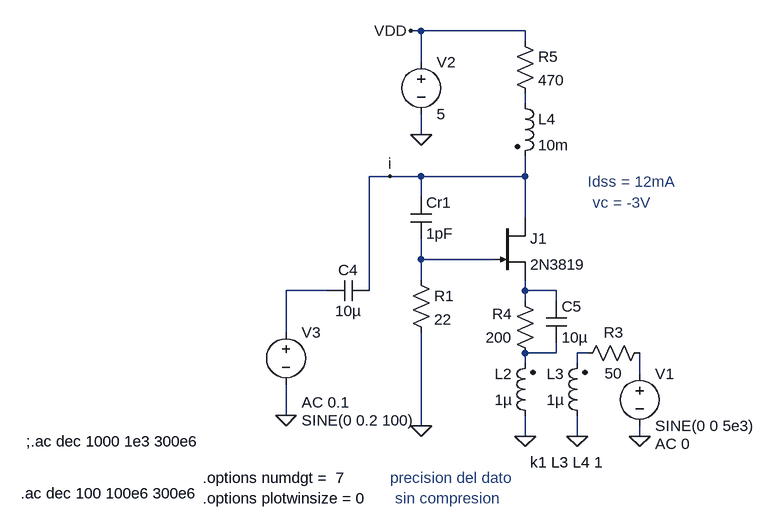
[diagram p0: schematic Draft1.asc]
Draft1.asc, the LTspice schematic file:
Version 4
SHEET 1 880 680
WIRE 176 -272 160 -272
WIRE 336 -272 176 -272
WIRE 336 -256 336 -272
WIRE 176 -224 176 -272
WIRE 336 -160 336 -176
WIRE 176 -112 176 -144
WIRE 128 -48 96 -48
WIRE 176 -48 128 -48
WIRE 336 -48 336 -80
WIRE 336 -48 176 -48
WIRE 176 -16 176 -48
WIRE 336 16 336 -48
WIRE 176 80 176 48
WIRE 288 80 176 80
WIRE 176 112 176 80
WIRE 32 128 -32 128
WIRE 96 128 96 -48
WIRE 336 128 336 112
WIRE 384 128 336 128
WIRE 336 144 336 128
WIRE 384 144 384 128
WIRE -32 192 -32 128
WIRE 384 224 384 208
WIRE 384 224 336 224
WIRE 432 224 416 224
WIRE 336 240 336 224
WIRE 416 240 416 224
WIRE 512 256 512 224
WIRE -32 320 -32 272
WIRE 176 336 176 192
WIRE 336 352 336 320
WIRE 416 352 416 320
WIRE 512 352 512 336
FLAG 176 336 0
FLAG 336 352 0
FLAG 416 352 0
FLAG 160 -272 VDD
FLAG 512 352 0
FLAG 176 -112 0
FLAG -32 320 0
FLAG 128 -48 i
SYMBOL cap 160 -16 R0
SYMATTR InstName Cr1
SYMATTR Value 1pF
SYMBOL res 160 96 R0
SYMATTR InstName R1
SYMATTR Value 22
SYMBOL ind2 352 336 R180
WINDOW 0 36 80 Left 2
WINDOW 3 36 40 Left 2
SYMATTR InstName L2
SYMATTR Value 1µ
SYMATTR Type ind
SYMBOL ind2 432 336 R180
WINDOW 0 36 80 Left 2
WINDOW 3 36 40 Left 2
SYMATTR InstName L3
SYMATTR Value 1µ
SYMATTR Type ind
SYMBOL njf 288 16 R0
SYMATTR InstName J1
SYMATTR Value 2N3819
SYMBOL voltage 512 240 R0
WINDOW 123 24 124 Left 2
WINDOW 39 24 124 Left 2
SYMATTR Value2 AC 0
SYMATTR InstName V1
SYMATTR Value SINE(0 0 5e3)
SYMBOL voltage 176 -240 R0
WINDOW 123 0 0 Left 0
WINDOW 39 0 0 Left 0
SYMATTR InstName V2
SYMATTR Value 5
SYMBOL cap 32 144 R270
WINDOW 0 32 32 VTop 2
WINDOW 3 0 32 VBottom 2
SYMATTR InstName C4
SYMATTR Value 10µ
SYMBOL res 528 208 R90
WINDOW 0 0 56 VBottom 2
WINDOW 3 32 56 VTop 2
SYMATTR InstName R3
SYMATTR Value 50
SYMBOL res 352 240 R180
WINDOW 0 36 76 Left 2
WINDOW 3 36 40 Left 2
SYMATTR InstName R4
SYMATTR Value 200
SYMBOL cap 368 144 R0
SYMATTR InstName C5
SYMATTR Value 10µ
SYMBOL res 320 -272 R0
SYMATTR InstName R5
SYMATTR Value 470
SYMBOL ind2 320 -176 R0
SYMATTR InstName L4
SYMATTR Value 10m
SYMATTR Type ind
SYMBOL voltage -32 176 R0
WINDOW 3 24 152 Left 2
WINDOW 123 24 124 Left 2
WINDOW 39 0 0 Left 0
SYMATTR InstName V3
SYMATTR Value SINE(0 0.2 100)
SYMATTR Value2 AC 0.1
TEXT 344 392 Left 2 !k1 L3 L4 1
TEXT -440 440 Left 2 !.ac dec 100 100e6 300e6
TEXT 432 -40 Left 2 ;Idss = 12mA
TEXT 440 -8 Left 2 ;vc = -3V
TEXT -160 416 Left 2 !.options numdgt =  7
TEXT -160 448 Left 2 !.options plotwinsize = 0
TEXT 128 416 Left 2 ;precision del dato
TEXT 136 448 Left 2 ;sin compresion
TEXT -432 360 Left 2 !;.ac dec 1000 1e3 300e6

The netlist it stands for:
* Draft1.asc
Cr1 i N002 1pF
R1 N002 0 22
L2 0 N005 1µ
L3 0 N006 1µ
J1 i N002 N004 2N3819
V1 N007 0 SINE(0 0 5e3) AC 0
V2 VDD 0 5
C4 N003 i 10µ
R3 N007 N006 50
R4 N005 N004 200
C5 N004 N005 10µ
R5 VDD N001 470
L4 N001 i 10m
V3 N003 0 SINE(0 0.2 100) AC 0.1
.model NJF NJF
.model PJF PJF
.lib standard.jft
k1 L3 L4 1
.ac dec 100 100e6 300e6
* Idss = 12mA
* vc = -3V
.options numdgt =  7
.options plotwinsize = 0
* precision del dato
* sin compresion
;.ac dec 1000 1e3 300e6
.backanno
.end